# EasyEDA schematic SCH_Lora Messenger_2024-02-14.json
TITLE: Sheet_1; REV: 1.0; Date: 2023-05-22; Sheet: 1/1; Drawn By: Nainaiu Rakhaine; Company: Your Company
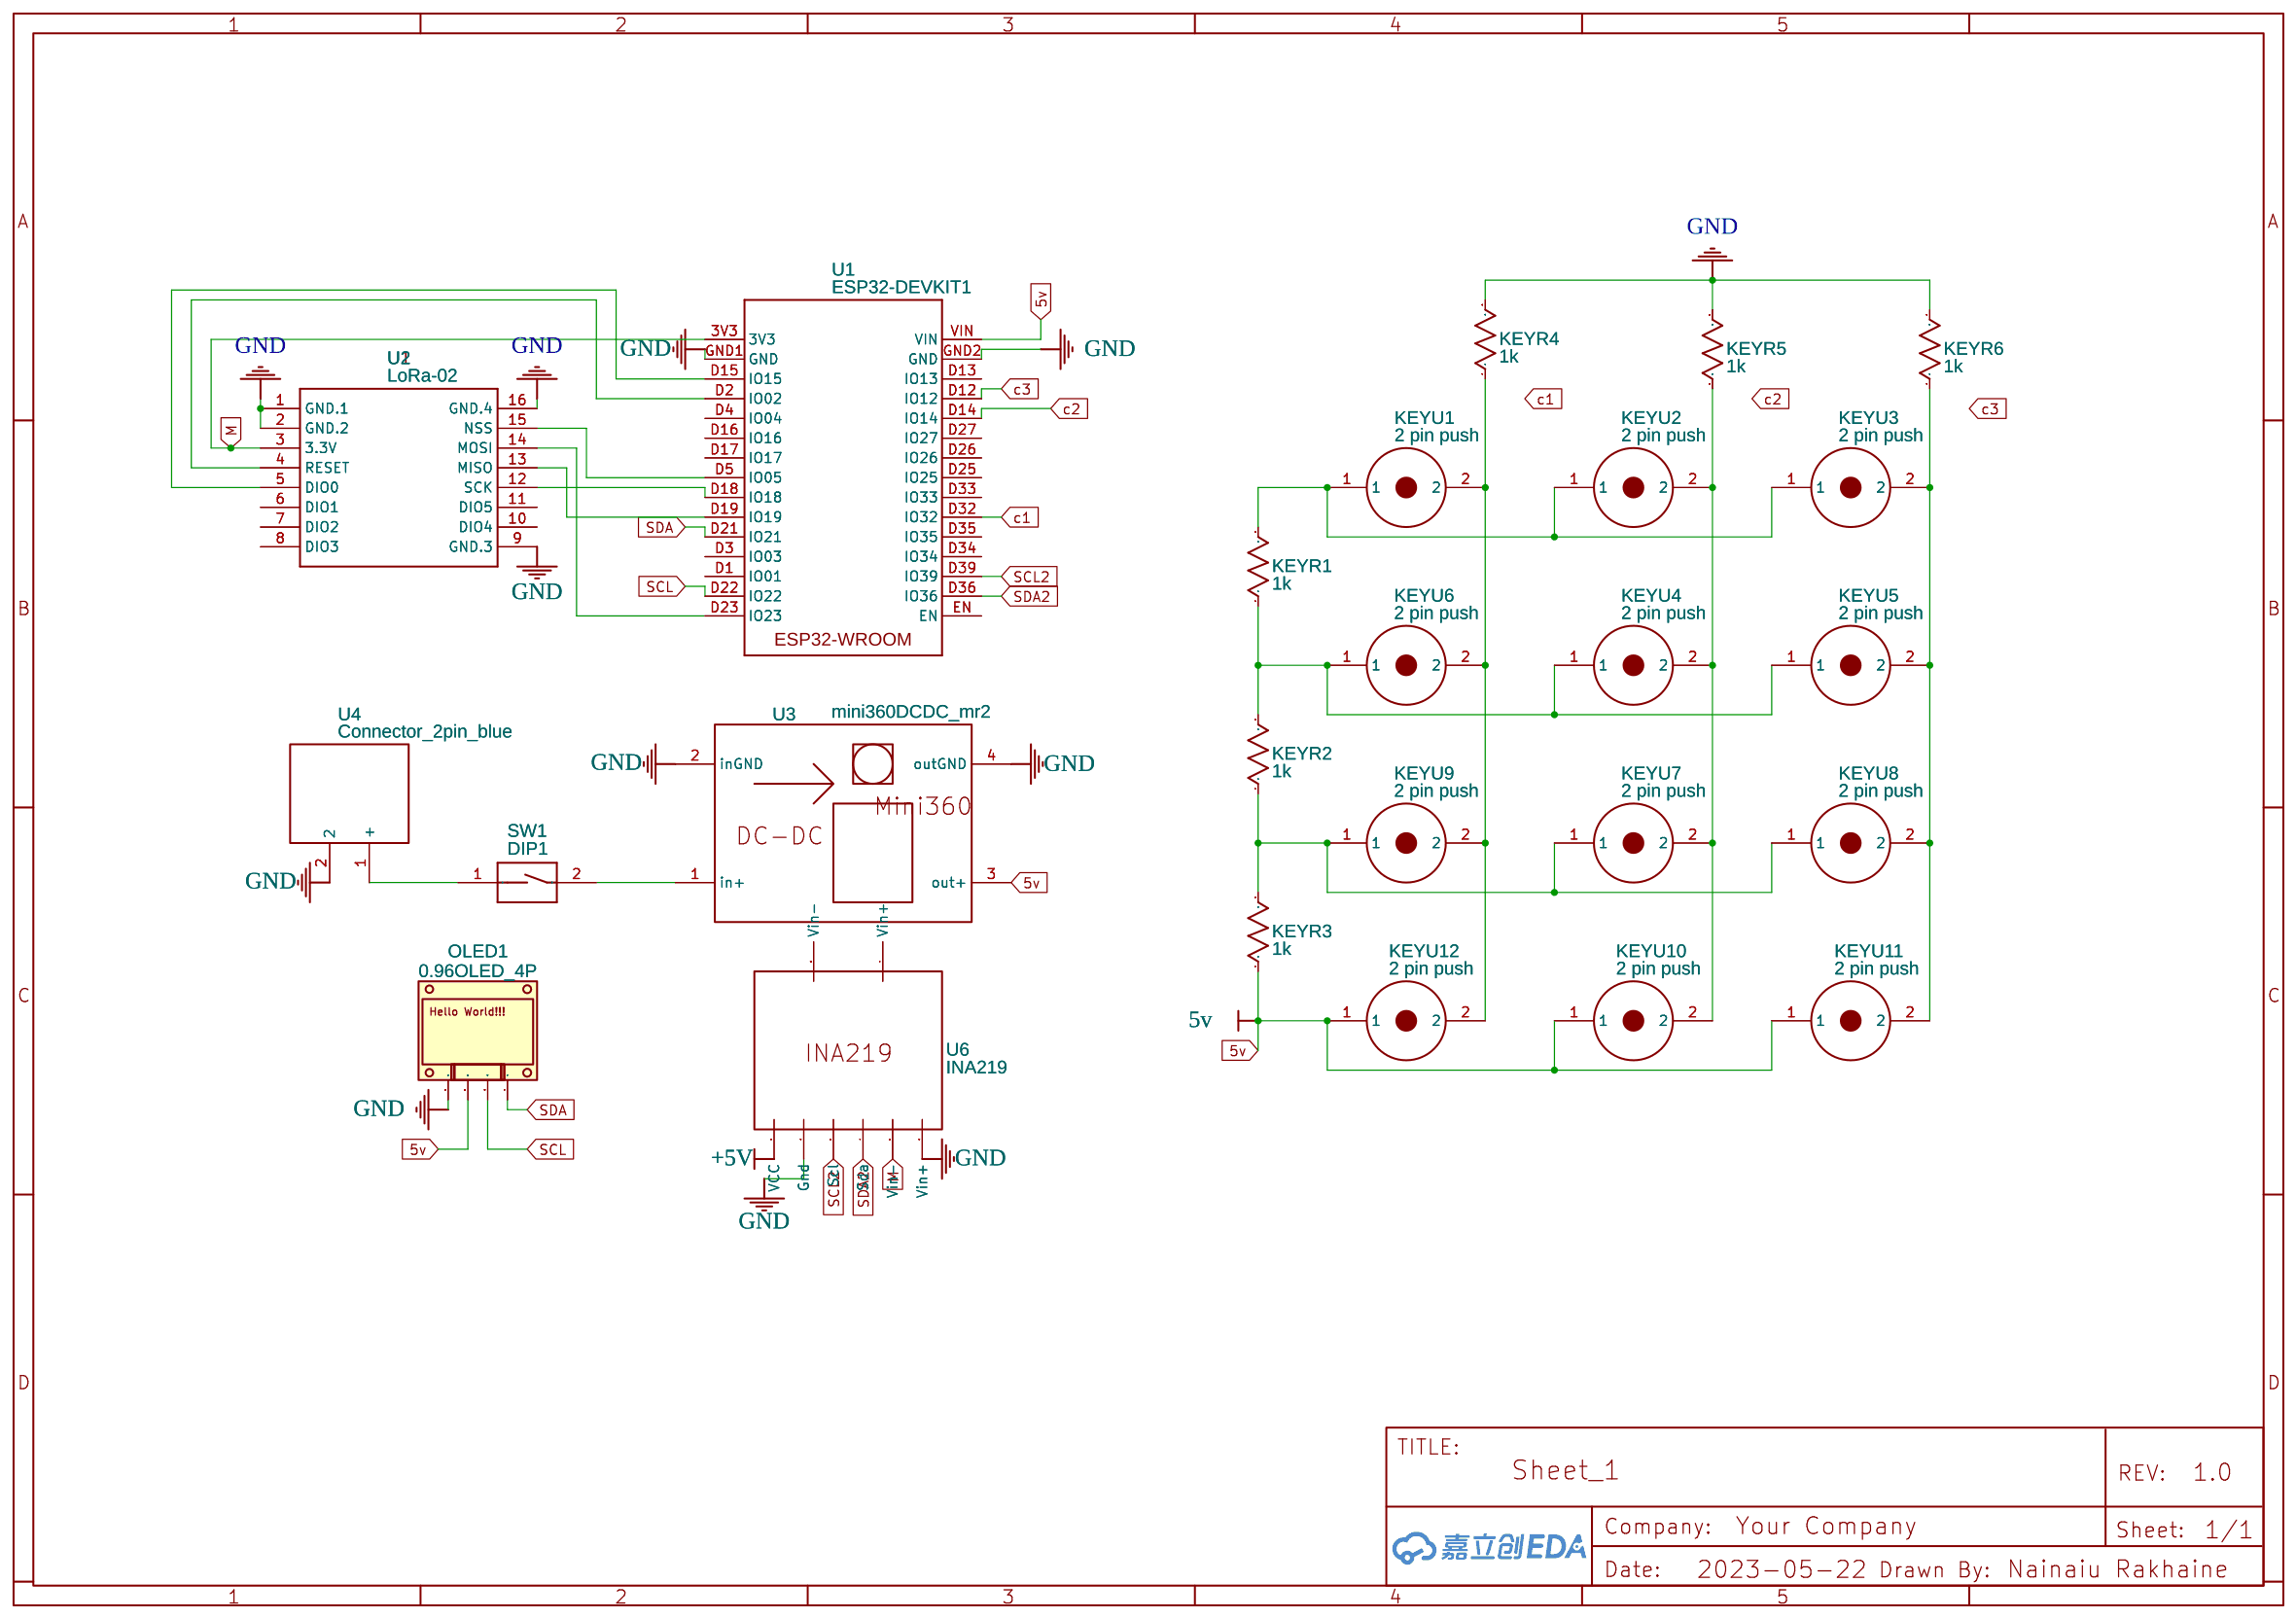
[diagram p0: schematic sheet]

## Parts
KEYR1  1k  [R_AXIAL-0.4]
KEYR2  1k  [R_AXIAL-0.4]
KEYR3  1k  [R_AXIAL-0.4]
KEYR4  1k  [R_AXIAL-0.4]
KEYR5  1k  [R_AXIAL-0.4]
KEYR6  1k  [R_AXIAL-0.4]
KEYU1  2 pin push  [2 PIN PUSH]
KEYU2  2 pin push  [2 PIN PUSH]
KEYU3  2 pin push  [2 PIN PUSH]
KEYU4  2 pin push  [2 PIN PUSH]
KEYU5  2 pin push  [2 PIN PUSH]
KEYU6  2 pin push  [2 PIN PUSH]
KEYU7  2 pin push  [2 PIN PUSH]
KEYU8  2 pin push  [2 PIN PUSH]
KEYU9  2 pin push  [2 PIN PUSH]
KEYU10  2 pin push  [2 PIN PUSH]
KEYU11  2 pin push  [2 PIN PUSH]
KEYU12  2 pin push  [2 PIN PUSH]
OLED1  0.96OLED_4P  [0.96OLED_4P]
SW1  DIP1  [DIP SWITCH DIP1]
U1  ESP32-DEVKIT1  [ESP32-DEVKIT1]
U2  LoRa-02  [LORA-02]
U3  mini360DCDC_mr2  [MINI360DCDC_MR]
U4  Connector_2pin_blue  [CONNECTOR_2PIN_BLUE]
U6  INA219  [INA219-AURDINO]

## Library data of the parts
KEYR1-KEYR6 = R_AXIAL-0.4_US: Contributor: LCEDA_Lib
KEYU1-KEYU12 = 2 pin push: Contributor: Nainaiu Rakhaine; Package Display: No
OLED1 = 0.96OLED_4P: Supplier: LCSC; Contributor: LCEDA_Lib
SW1 = DIP1: Supplier: Digi-Key; Manufacturer: Omron Electronics Inc-EMC Div; Manufacturer Part: A6TN-1101; Supplier Part: Z12167-ND; Contributor: ahmad902
U1 = ESP32-DEVKIT1: Contributor: enzo.e2house
U2 = LoRa-02: link: https://www.elecrow.com/sx1278-lora-module-433m-10km-ra-02-wireless-spread-spectrum-transmission-socket-for-smart-home-diy.html; Contributor: Morningstar
U3 = mini360DCDC_mr2: Contributor: miran.roser22
U4 = Connector_2pin_blue: Contributor: airat.nurt
U6 = INA219: Supplier: AdaFruit; link: https://www.adafruit.com/product/904; Contributor: Mage34

## Nets
5v: KEYR3.1 KEYU10.1 KEYU11.1 KEYU12.1 OLED1.2 U1.VIN U3.3(out+)
GND: KEYR4.2 KEYR5.2 KEYR6.2 OLED1.1 U1.GND1(GND) U1.GND2(GND) U2.1(GND.1) U2.2(GND.2) U2.9(GND.3) U2.16(GND.4) U3.2(inGND) U3.4(outGND) U4.2
c1: U1.D32(IO32)
c2: U1.D14(IO14)
c3: U1.D12(IO12)
M: U1.3V3 U2.3(3.3V)
SCL: OLED1.3 U1.D22(IO22)
SCL2: U1.D39(IO39)
SDA: OLED1.4 U1.D21(IO21)
SDA2: U1.D36(IO36)
Net-(KEYR1-1): KEYR1.1 KEYR2.2 KEYU4.1 KEYU5.1 KEYU6.1
Net-(KEYR1-2): KEYR1.2 KEYU1.1 KEYU2.1 KEYU3.1
Net-(KEYR2-1): KEYR2.1 KEYR3.2 KEYU7.1 KEYU8.1 KEYU9.1
Net-(KEYR4-1): KEYR4.1 KEYU1.2 KEYU6.2 KEYU9.2 KEYU12.2
Net-(KEYR5-1): KEYR5.1 KEYU2.2 KEYU4.2 KEYU7.2 KEYU10.2
Net-(KEYR6-1): KEYR6.1 KEYU3.2 KEYU5.2 KEYU8.2 KEYU11.2
Net-(SW1-1): SW1.1 U4.1(+)
Net-(SW1-2): SW1.2 U3.1(in+)
Net-(U1-D2): U1.D2(IO02) U2.4(RESET)
Net-(U1-D5): U1.D5(IO05) U2.15(NSS)
Net-(U1-D15): U1.D15(IO15) U2.5(DIO0)
Net-(U1-D18): U1.D18(IO18) U2.12(SCK)
Net-(U1-D19): U1.D19(IO19) U2.13(MISO)
Net-(U1-D23): U1.D23(IO23) U2.14(MOSI)

Not connected (* = marked no-connect by the designer): U1 D1(IO01) D3(IO03) D4(IO04) D13(IO13) D16(IO16) D17(IO17) D25(IO25) D26(IO26) D27(IO27) D33(IO33) D34(IO34) D35(IO35) EN; U2 6(DIO1) 7(DIO2) 8(DIO3) 10(DIO4) 11(DIO5); U6 1(VCC) 2(Gnd) 3(Scl) 4(Sda) 5(Vin-) 6(Vin+) 7(Vin+) 8(Vin-)
